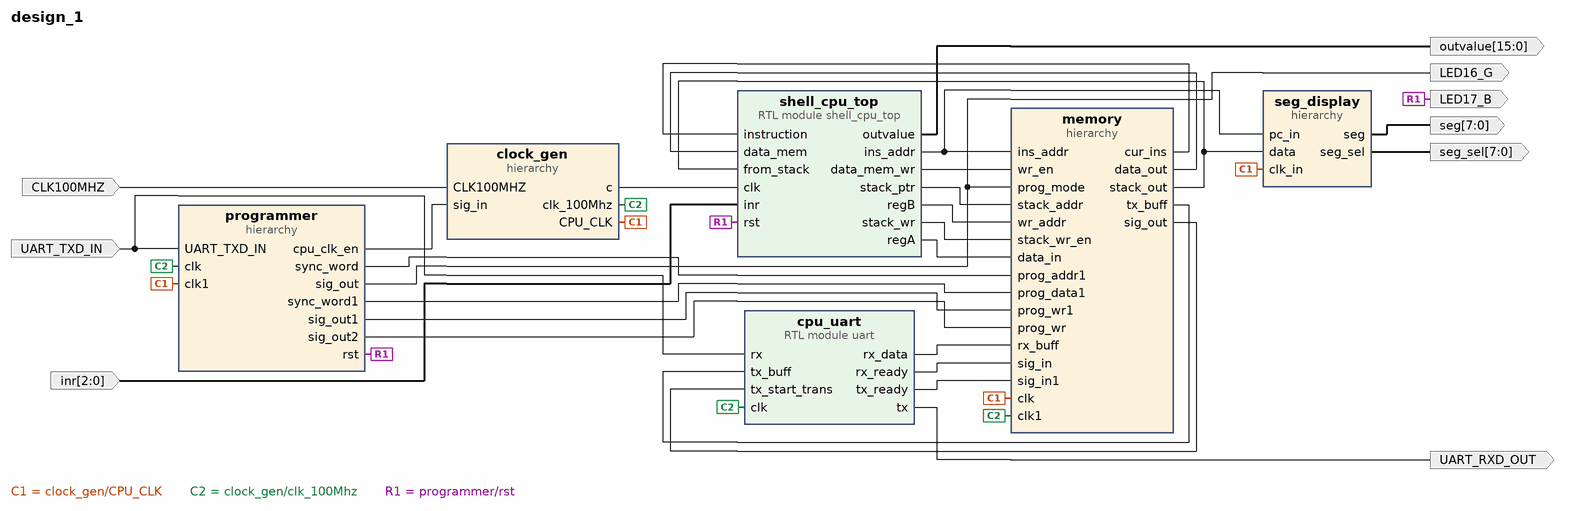
[diagram p0: block diagram of the top level]
# Vivado block design design_1, xc7a100tcsg324-1, Vivado 2018.3
create_bd_design design_1

create_bd_port -dir I CLK100MHZ
create_bd_port -dir I UART_TXD_IN
create_bd_port -dir O UART_RXD_OUT
create_bd_port -dir O -from 15 -to 0 outvalue
create_bd_port -dir I -from 2 -to 0 inr
create_bd_port -dir O -from 7 -to 0 seg
create_bd_port -dir O -from 7 -to 0 seg_sel
create_bd_port -dir O LED16_G
create_bd_port -dir O LED17_B

create_bd_cell -type hier programmer
create_bd_cell -type hier clock_gen
create_bd_cell -type module -reference uart cpu_uart
create_bd_cell -type hier memory
create_bd_cell -type module -reference shell_cpu_top shell_cpu_top
create_bd_cell -type hier seg_display

# ---- hierarchy /programmer ----
current_bd_instance /programmer
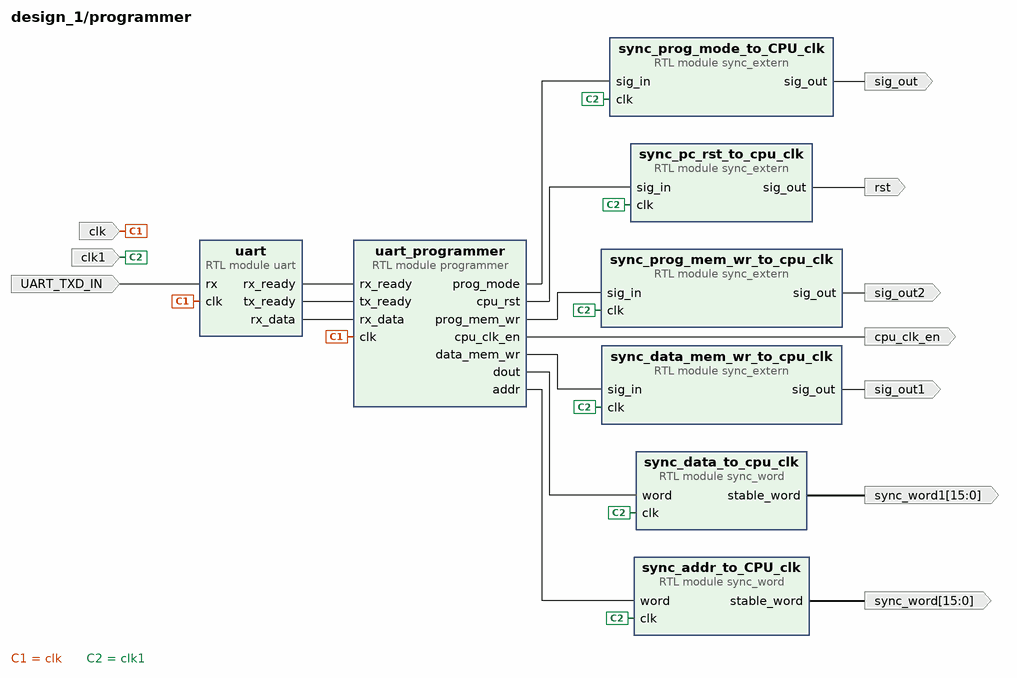
[diagram p1: block diagram inside /programmer]
create_bd_pin -dir I -type clk clk
create_bd_pin -dir I UART_TXD_IN
create_bd_pin -dir I -type clk clk1
create_bd_pin -dir O -from 15 -to 0 sync_word
create_bd_pin -dir O sig_out
create_bd_pin -dir O -from 15 -to 0 sync_word1
create_bd_pin -dir O sig_out1
create_bd_pin -dir O sig_out2
create_bd_pin -dir O cpu_clk_en
create_bd_pin -dir O rst

create_bd_cell -type module -reference uart uart
create_bd_cell -type module -reference sync_extern sync_prog_mode_to_CPU_clk
create_bd_cell -type module -reference sync_extern sync_data_mem_wr_to_cpu_clk
create_bd_cell -type module -reference sync_extern sync_prog_mem_wr_to_cpu_clk
create_bd_cell -type module -reference sync_word sync_addr_to_CPU_clk
create_bd_cell -type module -reference sync_word sync_data_to_cpu_clk
create_bd_cell -type module -reference sync_extern sync_pc_rst_to_cpu_clk
create_bd_cell -type module -reference programmer uart_programmer

# ---- hierarchy /clock_gen ----
current_bd_instance /clock_gen
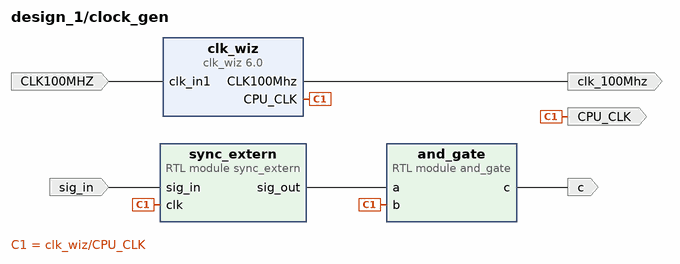
[diagram p2: block diagram inside /clock_gen]
create_bd_pin -dir O c
create_bd_pin -dir O -type clk clk_100Mhz
create_bd_pin -dir I -type clk CLK100MHZ
create_bd_pin -dir O -type clk CPU_CLK
create_bd_pin -dir I sig_in

create_bd_cell -type module -reference and_gate and_gate
create_bd_cell -type module -reference sync_extern sync_extern
create_bd_cell -type ip -vlnv xilinx.com:ip:clk_wiz:6.0 clk_wiz
set_property -dict [list \
  CONFIG.CLKOUT1_DRIVES BUFG \
  CONFIG.CLKOUT1_JITTER 219.371 \
  CONFIG.CLKOUT1_PHASE_ERROR 105.461 \
  CONFIG.CLKOUT1_REQUESTED_OUT_FREQ 10 \
  CONFIG.CLKOUT2_DRIVES BUFG \
  CONFIG.CLKOUT2_JITTER 137.681 \
  CONFIG.CLKOUT2_PHASE_ERROR 105.461 \
  CONFIG.CLKOUT2_USED true \
  CONFIG.CLKOUT3_DRIVES BUFG \
  CONFIG.CLKOUT4_DRIVES BUFG \
  CONFIG.CLKOUT5_DRIVES BUFG \
  CONFIG.CLKOUT6_DRIVES BUFG \
  CONFIG.CLKOUT7_DRIVES BUFG \
  CONFIG.CLK_OUT1_PORT CPU_CLK \
  CONFIG.CLK_OUT2_PORT CLK100Mhz \
  CONFIG.MMCM_CLKFBOUT_MULT_F 9 \
  CONFIG.MMCM_CLKIN1_PERIOD 10.000 \
  CONFIG.MMCM_CLKIN2_PERIOD 10.000 \
  CONFIG.MMCM_CLKOUT0_DIVIDE_F 90 \
  CONFIG.MMCM_CLKOUT1_DIVIDE 9 \
  CONFIG.MMCM_COMPENSATION ZHOLD \
  CONFIG.MMCM_DIVCLK_DIVIDE 1 \
  CONFIG.NUM_OUT_CLKS 2 \
  CONFIG.PRIMITIVE PLL \
  CONFIG.USE_LOCKED false \
  CONFIG.USE_RESET false \
] [get_bd_cells clk_wiz]

# ---- hierarchy /memory ----
current_bd_instance /memory
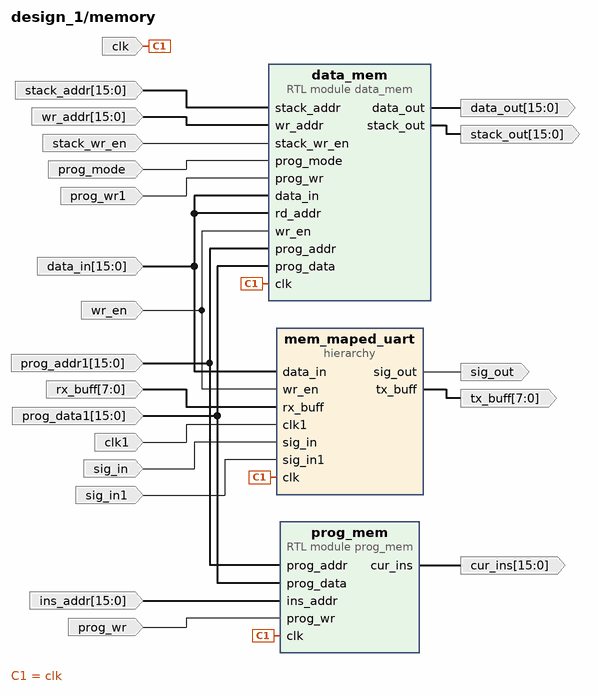
[diagram p3: block diagram inside /memory]
create_bd_pin -dir I -type clk clk
create_bd_pin -dir I -from 15 -to 0 ins_addr
create_bd_pin -dir O -from 15 -to 0 cur_ins
create_bd_pin -dir I -from 15 -to 0 stack_addr
create_bd_pin -dir O -from 15 -to 0 stack_out
create_bd_pin -dir I -from 15 -to 0 data_in
create_bd_pin -dir I -from 15 -to 0 wr_addr
create_bd_pin -dir O -from 15 -to 0 data_out
create_bd_pin -dir I wr_en
create_bd_pin -dir I stack_wr_en
create_bd_pin -dir I -from 15 -to 0 prog_addr1
create_bd_pin -dir I prog_mode
create_bd_pin -dir I -from 15 -to 0 prog_data1
create_bd_pin -dir I prog_wr1
create_bd_pin -dir I prog_wr
create_bd_pin -dir I -from 7 -to 0 rx_buff
create_bd_pin -dir O -from 7 -to 0 tx_buff
create_bd_pin -dir I -type clk clk1
create_bd_pin -dir O sig_out
create_bd_pin -dir I sig_in
create_bd_pin -dir I sig_in1

create_bd_cell -type module -reference prog_mem prog_mem
create_bd_cell -type hier mem_maped_uart
create_bd_cell -type module -reference data_mem data_mem

# ---- hierarchy /memory/mem_maped_uart ----
current_bd_instance /memory/mem_maped_uart
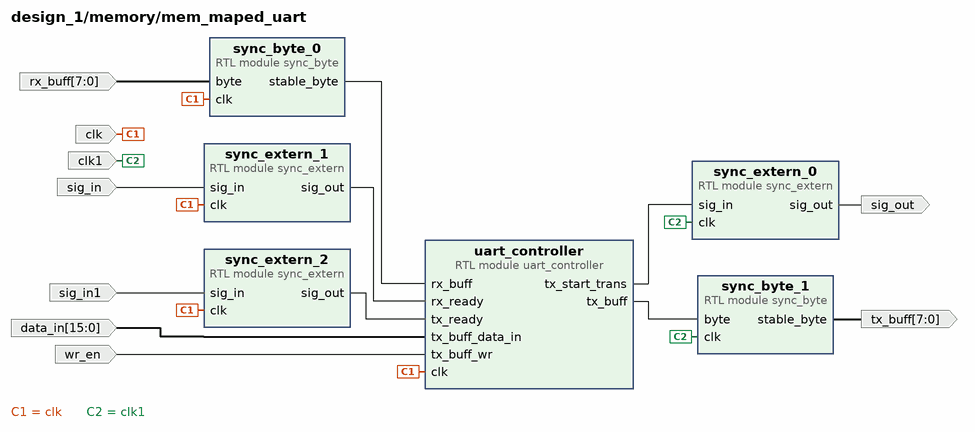
[diagram p4: block diagram inside /memory/mem_maped_uart]
create_bd_pin -dir I -type clk clk
create_bd_pin -dir O -from 7 -to 0 tx_buff
create_bd_pin -dir I -from 7 -to 0 rx_buff
create_bd_pin -dir I -type clk clk1
create_bd_pin -dir O sig_out
create_bd_pin -dir I sig_in
create_bd_pin -dir I sig_in1
create_bd_pin -dir I -from 15 -to 0 data_in
create_bd_pin -dir I wr_en

create_bd_cell -type module -reference sync_extern sync_extern_0
create_bd_cell -type module -reference sync_extern sync_extern_1
create_bd_cell -type module -reference sync_extern sync_extern_2
create_bd_cell -type module -reference sync_byte sync_byte_0
create_bd_cell -type module -reference sync_byte sync_byte_1
create_bd_cell -type module -reference uart_controller uart_controller

# ---- hierarchy /seg_display ----
current_bd_instance /seg_display
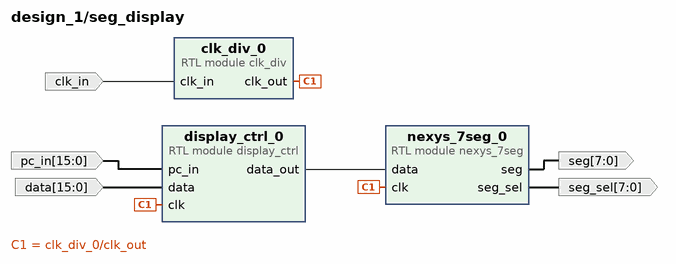
[diagram p5: block diagram inside /seg_display]
create_bd_pin -dir O -from 7 -to 0 seg_sel
create_bd_pin -dir O -from 7 -to 0 seg
create_bd_pin -dir I clk_in
create_bd_pin -dir I -from 15 -to 0 pc_in
create_bd_pin -dir I -from 15 -to 0 data

create_bd_cell -type module -reference display_ctrl display_ctrl_0
create_bd_cell -type module -reference nexys_7seg nexys_7seg_0
create_bd_cell -type module -reference clk_div clk_div_0

# ---- connections ----

current_bd_instance /programmer
connect_bd_net [get_bd_pins uart_programmer/dout] [get_bd_pins sync_data_to_cpu_clk/word]
connect_bd_net [get_bd_pins uart_programmer/addr] [get_bd_pins sync_addr_to_CPU_clk/word]
connect_bd_net [get_bd_pins clk] [get_bd_pins uart/clk] [get_bd_pins uart_programmer/clk]
connect_bd_net [get_bd_pins uart/rx_ready] [get_bd_pins uart_programmer/rx_ready]
connect_bd_net [get_bd_pins uart/tx_ready] [get_bd_pins uart_programmer/tx_ready]
connect_bd_net [get_bd_pins uart/rx_data] [get_bd_pins uart_programmer/rx_data]
connect_bd_net [get_bd_pins UART_TXD_IN] [get_bd_pins uart/rx]
connect_bd_net -net clk1_1 [get_bd_pins clk1] \
  [get_bd_pins sync_prog_mode_to_CPU_clk/clk] [get_bd_pins sync_data_mem_wr_to_cpu_clk/clk] \
  [get_bd_pins sync_prog_mem_wr_to_cpu_clk/clk] [get_bd_pins sync_addr_to_CPU_clk/clk] [get_bd_pins sync_data_to_cpu_clk/clk] \
  [get_bd_pins sync_pc_rst_to_cpu_clk/clk]
connect_bd_net -net sync_word_to_CPU_clk_sync_word [get_bd_pins sync_addr_to_CPU_clk/stable_word] [get_bd_pins sync_word]
connect_bd_net -net sync_extern_1_sig_out [get_bd_pins sync_prog_mode_to_CPU_clk/sig_out] [get_bd_pins sig_out]
connect_bd_net -net sync_extern_0_sig_out [get_bd_pins sync_data_mem_wr_to_cpu_clk/sig_out] [get_bd_pins sig_out1]
connect_bd_net [get_bd_pins uart_programmer/data_mem_wr] [get_bd_pins sync_data_mem_wr_to_cpu_clk/sig_in]
connect_bd_net [get_bd_pins uart_programmer/prog_mem_wr] [get_bd_pins sync_prog_mem_wr_to_cpu_clk/sig_in]
connect_bd_net -net sync_extern_0_sig_out1 [get_bd_pins sync_prog_mem_wr_to_cpu_clk/sig_out] [get_bd_pins sig_out2]
connect_bd_net [get_bd_pins sync_data_to_cpu_clk/stable_word] [get_bd_pins sync_word1]
connect_bd_net [get_bd_pins uart_programmer/prog_mode] [get_bd_pins sync_prog_mode_to_CPU_clk/sig_in]
connect_bd_net [get_bd_pins uart_programmer/cpu_clk_en] [get_bd_pins cpu_clk_en]
connect_bd_net [get_bd_pins uart_programmer/cpu_rst] [get_bd_pins sync_pc_rst_to_cpu_clk/sig_in]
connect_bd_net [get_bd_pins sync_pc_rst_to_cpu_clk/sig_out] [get_bd_pins rst]

current_bd_instance /clock_gen
connect_bd_net [get_bd_pins and_gate/c] [get_bd_pins c]
connect_bd_net -net b_1 [get_bd_pins clk_wiz/CPU_CLK] [get_bd_pins and_gate/b] [get_bd_pins sync_extern/clk] [get_bd_pins CPU_CLK]
connect_bd_net [get_bd_pins sync_extern/sig_out] [get_bd_pins and_gate/a]
connect_bd_net [get_bd_pins CLK100MHZ] [get_bd_pins clk_wiz/clk_in1]
connect_bd_net [get_bd_pins clk_wiz/CLK100Mhz] [get_bd_pins clk_100Mhz]
connect_bd_net [get_bd_pins sig_in] [get_bd_pins sync_extern/sig_in]

current_bd_instance /memory
connect_bd_net [get_bd_pins clk] [get_bd_pins prog_mem/clk] [get_bd_pins mem_maped_uart/clk] [get_bd_pins data_mem/clk]
connect_bd_net [get_bd_pins ins_addr] [get_bd_pins prog_mem/ins_addr]
connect_bd_net [get_bd_pins prog_mem/cur_ins] [get_bd_pins cur_ins]
connect_bd_net [get_bd_pins stack_addr] [get_bd_pins data_mem/stack_addr]
connect_bd_net [get_bd_pins data_mem/stack_out] [get_bd_pins stack_out]
connect_bd_net [get_bd_pins data_in] [get_bd_pins mem_maped_uart/data_in] [get_bd_pins data_mem/rd_addr] [get_bd_pins data_mem/data_in]
connect_bd_net [get_bd_pins wr_addr] [get_bd_pins data_mem/wr_addr]
connect_bd_net [get_bd_pins data_mem/data_out] [get_bd_pins data_out]
connect_bd_net [get_bd_pins wr_en] [get_bd_pins mem_maped_uart/wr_en] [get_bd_pins data_mem/wr_en]
connect_bd_net [get_bd_pins stack_wr_en] [get_bd_pins data_mem/stack_wr_en]
connect_bd_net -net prog_addr1_1 [get_bd_pins prog_addr1] [get_bd_pins prog_mem/prog_addr] [get_bd_pins data_mem/prog_addr]
connect_bd_net [get_bd_pins prog_mode] [get_bd_pins data_mem/prog_mode]
connect_bd_net -net prog_data1_1 [get_bd_pins prog_data1] [get_bd_pins prog_mem/prog_data] [get_bd_pins data_mem/prog_data]
connect_bd_net -net prog_wr1_1 [get_bd_pins prog_wr1] [get_bd_pins data_mem/prog_wr]
connect_bd_net [get_bd_pins prog_wr] [get_bd_pins prog_mem/prog_wr]
connect_bd_net [get_bd_pins rx_buff] [get_bd_pins mem_maped_uart/rx_buff]
connect_bd_net -net uart_controller_0_tx_buff [get_bd_pins mem_maped_uart/tx_buff] [get_bd_pins tx_buff]
connect_bd_net -net clk1_1 [get_bd_pins clk1] [get_bd_pins mem_maped_uart/clk1]
connect_bd_net [get_bd_pins mem_maped_uart/sig_out] [get_bd_pins sig_out]
connect_bd_net [get_bd_pins sig_in] [get_bd_pins mem_maped_uart/sig_in]
connect_bd_net -net sig_in1_1 [get_bd_pins sig_in1] [get_bd_pins mem_maped_uart/sig_in1]

current_bd_instance /memory/mem_maped_uart
connect_bd_net [get_bd_pins clk] \
  [get_bd_pins sync_extern_1/clk] [get_bd_pins sync_extern_2/clk] [get_bd_pins sync_byte_0/clk] \
  [get_bd_pins uart_controller/clk]
connect_bd_net [get_bd_pins uart_controller/tx_start_trans] [get_bd_pins sync_extern_0/sig_in]
connect_bd_net -net clk1_1 [get_bd_pins clk1] [get_bd_pins sync_extern_0/clk] [get_bd_pins sync_byte_1/clk]
connect_bd_net [get_bd_pins sync_extern_0/sig_out] [get_bd_pins sig_out]
connect_bd_net [get_bd_pins rx_buff] [get_bd_pins sync_byte_0/byte]
connect_bd_net -net sync_byte_0_stable_word [get_bd_pins sync_byte_0/stable_byte] [get_bd_pins uart_controller/rx_buff]
connect_bd_net [get_bd_pins sync_extern_1/sig_out] [get_bd_pins uart_controller/rx_ready]
connect_bd_net [get_bd_pins sig_in] [get_bd_pins sync_extern_1/sig_in]
connect_bd_net -net sig_in1_1 [get_bd_pins sig_in1] [get_bd_pins sync_extern_2/sig_in]
connect_bd_net [get_bd_pins sync_extern_2/sig_out] [get_bd_pins uart_controller/tx_ready]
connect_bd_net [get_bd_pins uart_controller/tx_buff] [get_bd_pins sync_byte_1/byte]
connect_bd_net -net sync_byte_1_stable_word [get_bd_pins sync_byte_1/stable_byte] [get_bd_pins tx_buff]
connect_bd_net [get_bd_pins data_in] [get_bd_pins uart_controller/tx_buff_data_in]
connect_bd_net [get_bd_pins wr_en] [get_bd_pins uart_controller/tx_buff_wr]

current_bd_instance /seg_display
connect_bd_net [get_bd_pins nexys_7seg_0/seg_sel] [get_bd_pins seg_sel]
connect_bd_net [get_bd_pins nexys_7seg_0/seg] [get_bd_pins seg]
connect_bd_net [get_bd_pins clk_div_0/clk_out] [get_bd_pins display_ctrl_0/clk] [get_bd_pins nexys_7seg_0/clk]
connect_bd_net [get_bd_pins display_ctrl_0/data_out] [get_bd_pins nexys_7seg_0/data]
connect_bd_net [get_bd_pins clk_in] [get_bd_pins clk_div_0/clk_in]
connect_bd_net [get_bd_pins pc_in] [get_bd_pins display_ctrl_0/pc_in]
connect_bd_net [get_bd_pins data] [get_bd_pins display_ctrl_0/data]

current_bd_instance /
connect_bd_net [get_bd_pins memory/cur_ins] [get_bd_pins shell_cpu_top/instruction]
connect_bd_net [get_bd_pins memory/data_out] [get_bd_pins shell_cpu_top/data_mem]
connect_bd_net [get_bd_pins memory/stack_out] [get_bd_pins shell_cpu_top/from_stack] [get_bd_pins seg_display/data]
connect_bd_net [get_bd_ports UART_TXD_IN] [get_bd_pins programmer/UART_TXD_IN] [get_bd_pins cpu_uart/rx]
connect_bd_net [get_bd_ports CLK100MHZ] [get_bd_pins clock_gen/CLK100MHZ]
connect_bd_net -net clk_2 [get_bd_pins clock_gen/CPU_CLK] [get_bd_pins programmer/clk1] [get_bd_pins memory/clk] [get_bd_pins seg_display/clk_in]
connect_bd_net -net prog_addr1_1 [get_bd_pins programmer/sync_word] [get_bd_pins memory/prog_addr1]
connect_bd_net -net prog_mode_2 [get_bd_pins programmer/sig_out] [get_bd_pins memory/prog_mode] [get_bd_ports LED16_G]
connect_bd_net -net prog_data1_1 [get_bd_pins programmer/sync_word1] [get_bd_pins memory/prog_data1]
connect_bd_net -net prog_wr1_1 [get_bd_pins programmer/sig_out1] [get_bd_pins memory/prog_wr1]
connect_bd_net [get_bd_pins programmer/sig_out2] [get_bd_pins memory/prog_wr]
connect_bd_net [get_bd_pins clock_gen/clk_100Mhz] [get_bd_pins programmer/clk] [get_bd_pins cpu_uart/clk] [get_bd_pins memory/clk1]
connect_bd_net [get_bd_pins programmer/cpu_clk_en] [get_bd_pins clock_gen/sig_in]
connect_bd_net [get_bd_ports inr] [get_bd_pins shell_cpu_top/inr]
connect_bd_net -net async_rst_1 [get_bd_pins programmer/rst] [get_bd_pins shell_cpu_top/rst] [get_bd_ports LED17_B]
connect_bd_net -net shell_cpu_top_0_data_mem_wr [get_bd_pins shell_cpu_top/data_mem_wr] [get_bd_pins memory/wr_en]
connect_bd_net -net shell_cpu_top_0_stack_ptr [get_bd_pins shell_cpu_top/stack_ptr] [get_bd_pins memory/stack_addr]
connect_bd_net -net shell_cpu_top_0_ins_addr [get_bd_pins shell_cpu_top/ins_addr] [get_bd_pins memory/ins_addr] [get_bd_pins seg_display/pc_in]
connect_bd_net -net shell_cpu_top_0_outvalue [get_bd_pins shell_cpu_top/outvalue] [get_bd_ports outvalue]
connect_bd_net -net shell_cpu_top_0_regB [get_bd_pins shell_cpu_top/regB] [get_bd_pins memory/wr_addr]
connect_bd_net -net shell_cpu_top_0_stack_wr [get_bd_pins shell_cpu_top/stack_wr] [get_bd_pins memory/stack_wr_en]
connect_bd_net -net shell_cpu_top_0_regA [get_bd_pins shell_cpu_top/regA] [get_bd_pins memory/data_in]
connect_bd_net -net uart_0_tx [get_bd_pins cpu_uart/tx] [get_bd_ports UART_RXD_OUT]
connect_bd_net -net uart_0_rx_data [get_bd_pins cpu_uart/rx_data] [get_bd_pins memory/rx_buff]
connect_bd_net [get_bd_pins memory/tx_buff] [get_bd_pins cpu_uart/tx_buff]
connect_bd_net [get_bd_pins memory/sig_out] [get_bd_pins cpu_uart/tx_start_trans]
connect_bd_net [get_bd_pins cpu_uart/rx_ready] [get_bd_pins memory/sig_in]
connect_bd_net [get_bd_pins cpu_uart/tx_ready] [get_bd_pins memory/sig_in1]
connect_bd_net [get_bd_pins seg_display/seg_sel] [get_bd_ports seg_sel]
connect_bd_net [get_bd_pins seg_display/seg] [get_bd_ports seg]
connect_bd_net [get_bd_pins clock_gen/c] [get_bd_pins shell_cpu_top/clk]

validate_bd_design
save_bd_design
